# EAGLE design clock (EAGLE 6.4)
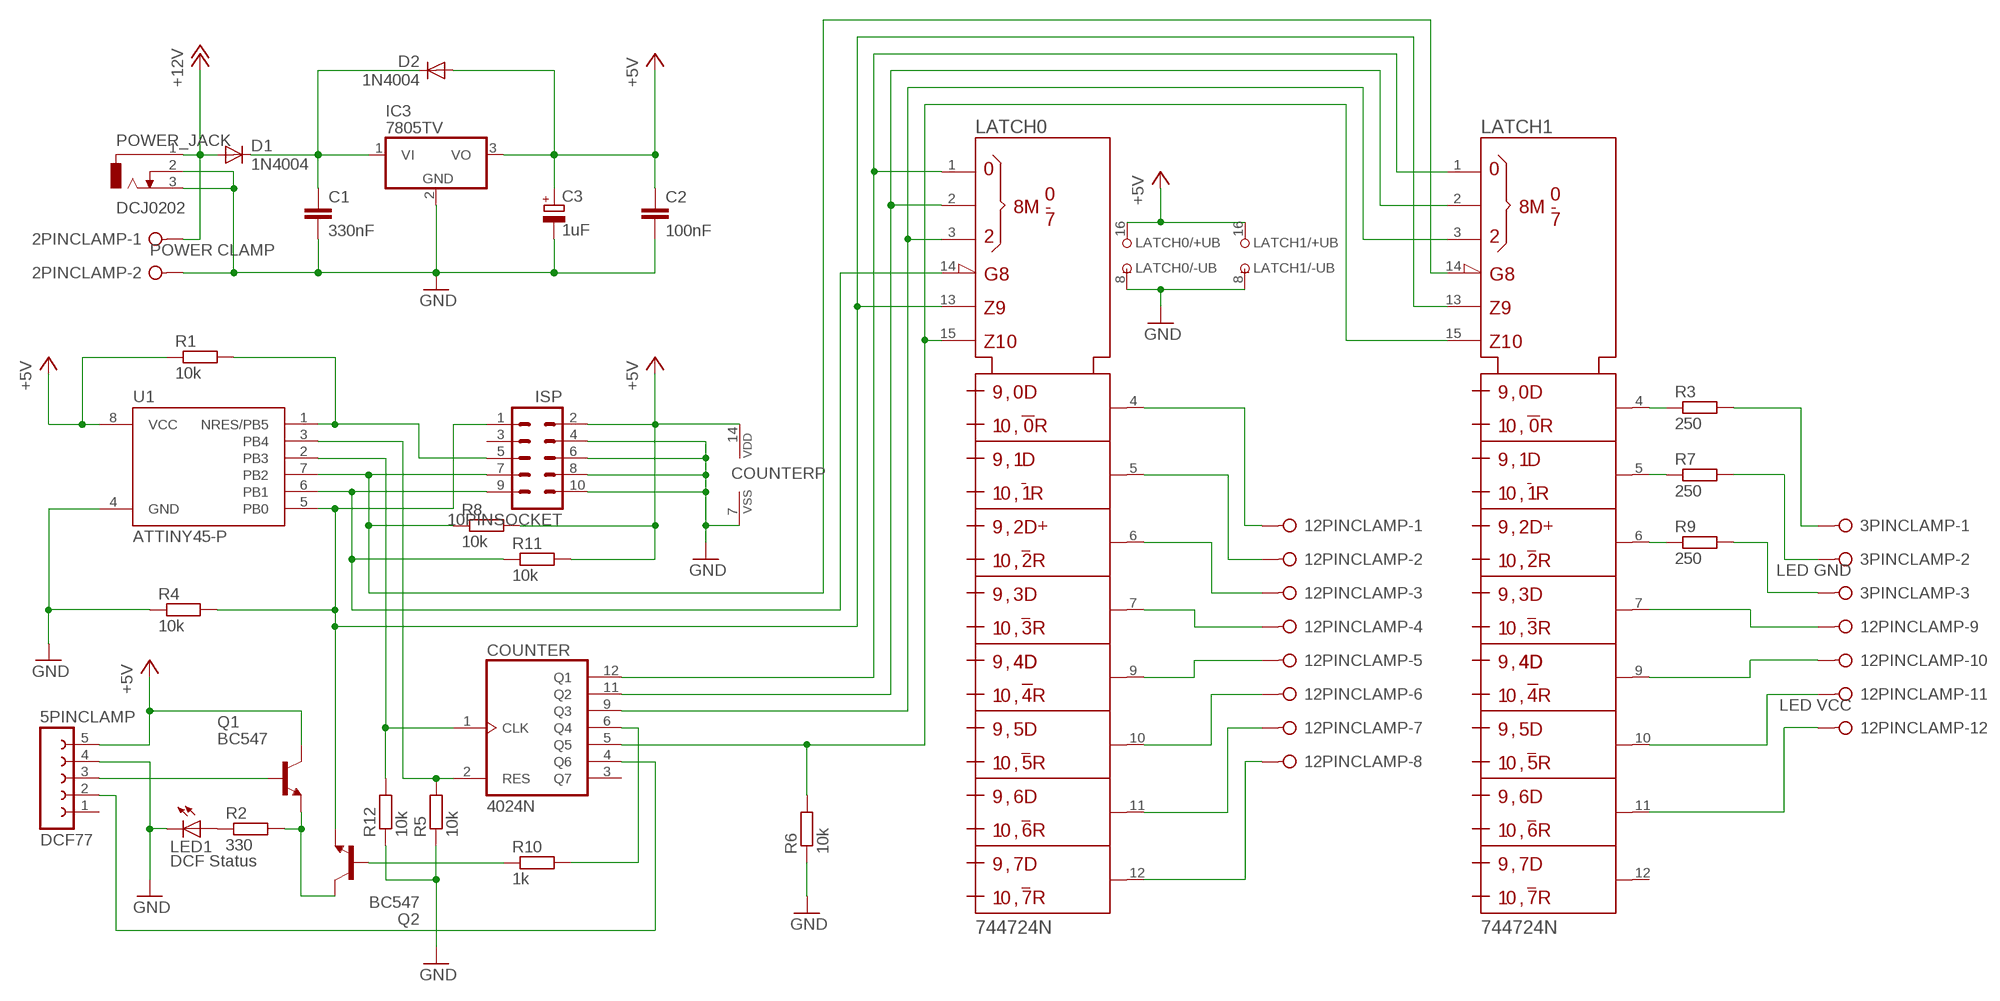
[diagram p0: schematic, sheet 1]

## Parts
2PINCLAMP  POWER CLAMP  W237-02P  [W237-132]
3PINCLAMP  LED GND  W237-3E  [W237-3E]
5PINCLAMP  DCF77  FE05-1  [FE05-1]
10PINSOCKET  ISP  ML10  [ML10]
12PINCLAMP  LED VCC  W237-12P  [W237-12P]
C1  330nF  C-EU050-025X075  [C050-025X075]
C2  100nF  C-EU050-025X075  [C050-025X075]
C3  1uF  CPOL-EUE2-4  [E2-4]
COUNTER  4024N  [DIL14]
D1  1N4004  [DO41-10]
D2  1N4004  [DO41-10]
IC3  7805TV  [TO220V]
LATCH0  744724N  [DIL16]
LATCH1  744724N  [DIL16]
LED1  DCF Status  LED5MM  [LED5MM]
POWER_JACK  DCJ0202  [DCJ0202]
Q1  BC547  [TO92]
Q2  BC547  [TO92]
R1  10k  R-EU_0204/5  [0204/5]
R2  330  R-EU_0204/5  [0204/5]
R3  250  R-EU_0204/5  [0204/5]
R4  10k  R-EU_0204/5  [0204/5]
R5  10k  R-EU_0204/5  [0204/5]
R6  10k  R-EU_0204/5  [0204/5]
R7  250  R-EU_0204/5  [0204/5]
R8  10k  R-EU_0204/5  [0204/5]
R9  250  R-EU_0204/5  [0204/5]
R10  1k  R-EU_0204/5  [0204/5]
R11  10k  R-EU_0204/5  [0204/5]
R12  10k  R-EU_0204/5  [0204/5]
U1  ATTINY45-P  [PDIP08_300MIL]

## Nets
+5V: 5PINCLAMP.5 10PINSOCKET.2 C2.1 C3.+ COUNTER.14(VDD) D2.A IC3.3(VO) LATCH0.16(+UB) LATCH1.16(+UB) Q1.3(C) R1.1 R8.2 R11.2 U1.8(VCC)
+12V: 2PINCLAMP.1 D1.A POWER_JACK.1
CLOCK: COUNTER.1(CLK) R12.2 U1.2(PB3)
DATA: 10PINSOCKET.1 LATCH0.13(D) LATCH1.13(D) Q2.1(E) R4.2 U1.5(PB0)
DCF_DATA: 5PINCLAMP.3 Q1.2(B)
DCF_PON: 5PINCLAMP.2 COUNTER.4(Q6)
GND: 2PINCLAMP.2 5PINCLAMP.4 10PINSOCKET.4 10PINSOCKET.6 10PINSOCKET.8 10PINSOCKET.10 C1.2 C2.2 C3.- COUNTER.7(VSS) IC3.2(GND) LATCH0.8(-UB) LATCH1.8(-UB) LED1.K(C) POWER_JACK.2 POWER_JACK.3 R4.1 R5.1 R6.1 R12.1 U1.4(GND)
LATCH0: 10PINSOCKET.7 LATCH1.14(!G) R8.1 U1.7(PB2)
LATCH1: 10PINSOCKET.9 LATCH0.14(!G) R11.1 U1.6(PB1)
N$1: 12PINCLAMP.1 LATCH0.4(Q0)
N$2: 12PINCLAMP.6 LATCH0.10(Q5)
N$3: 12PINCLAMP.2 LATCH0.5(Q1)
N$4: 12PINCLAMP.8 LATCH0.12(Q7)
N$5: 12PINCLAMP.7 LATCH0.11(Q6)
N$6: 12PINCLAMP.5 LATCH0.9(Q4)
N$7: 12PINCLAMP.4 LATCH0.7(Q3)
N$8: 12PINCLAMP.3 LATCH0.6(Q2)
N$9: 3PINCLAMP.2 R7.2
N$10: 3PINCLAMP.3 R9.2
N$11: 12PINCLAMP.9 LATCH1.7(Q3)
N$13: LATCH1.4(Q0) R3.1
N$14: 12PINCLAMP.11 LATCH1.10(Q5)
N$15: 12PINCLAMP.12 LATCH1.11(Q6)
N$16: LED1.A R2.1
N$17: C1.1 D1.C D2.C IC3.1(VI)
N$18: Q1.1(E) Q2.3(C) R2.2
N$19: LATCH1.6(Q2) R9.1
N$20: COUNTER.6(Q4) R10.2
N$21: LATCH1.5(Q1) R7.1
N$22: COUNTER.5(Q5) LATCH0.15(CLR) LATCH1.15(CLR) R6.2
N$23: 10PINSOCKET.5 R1.2 U1.1(NRES/PB5)
N$24: COUNTER.12(Q1) LATCH0.1(S0) LATCH1.1(S0)
N$25: Q2.2(B) R10.1
N$26: 3PINCLAMP.1 R3.2
N$27: COUNTER.9(Q3) LATCH0.3(S2) LATCH1.3(S2)
N$28: COUNTER.11(Q2) LATCH0.2(S1) LATCH1.2(S1)
N$30: 12PINCLAMP.10 LATCH1.9(Q4)
RESET: COUNTER.2(RES) R5.2 U1.3(PB4)
Unconnected: 5PINCLAMP.1 10PINSOCKET.3 COUNTER.3(Q7) LATCH1.12(Q7)

## Library data of the parts
2PINCLAMP = con-wago-508:W237-02P: WAGO SREW CLAMP; OC_FARNELL: unknown; OC_NEWARK: unknown
3PINCLAMP = con-wago-508:W237-3E: WAGO SREW CLAMP; OC_FARNELL: unknown; OC_NEWARK: unknown
5PINCLAMP = con-lsta:FE05-1: FEMALE HEADER; OC_FARNELL: unknown; OC_NEWARK: unknown
10PINSOCKET = con-harting-ml:ML10: HARTING; OC_FARNELL: unknown; OC_NEWARK: unknown
12PINCLAMP = con-wago-508:W237-12P: WAGO SREW CLAMP; OC_FARNELL: unknown; OC_NEWARK: unknown
C1 C2 = rcl:C-EU: CAPACITOR, European symbol
C3 = rcl:CPOL-EU: POLARIZED CAPACITOR, European symbol
COUNTER = 40xx:4024: 7-stage binary/ripple COUNTER
D1 D2 = diode:1N4004: DIODE general purpose rectifier, 1 A
IC3 = linear:78*: Positive VOLTAGE REGULATOR Source: http://cache.national.com/ds/LM/LM78L05.pdf http://www.fairchildsemi.com/ds/LM/LM7805.pdf
LATCH0 LATCH1 = 74ttl-din:74*4724: 8 Bit Addressable LATCH
LED1 = led:LED: LED OSRAM: - CHIPLED LG R971, LG N971, LY N971, LG Q971, LY Q971, LO R971, LY R971 LH N974, LH R974 LS Q976, LO Q976, LY Q976 LO Q996 - Hyper CHIPLED LW Q18S LB Q993, LB Q99A, LB R99A - SideLED LS A670, LO A670, LY A670, LG A670, LP A670 LB A673, LV A673, LT A673, LW A673 LH A674 LY A675 LS A676, LA A676, LO A676, LY A676, LW A676 LS A679, LY A679, LG A679 - Hyper Micro SIDELED® LS Y876, LA Y876, LO Y876, LY Y876 LT Y87S - SmartLED LW L88C, LW L88S LB L89C, LB L89S, LG L890 LS L89K, LO L89K, LY L89K LS L896, LA L896, LO L896, LY L896 - TOPLED LS T670, LO T670, LY T670, LG T670, LP T670 LSG T670, LSP T670, LSY T670, LOP T670, LYG T670 LG T671, LOG T671, LSG T671 LB T673, LV T673, LT T673, LW T673 LH T674 LS T676, LA T676, LO T676, LY T676, LB T676, LH T676, LSB T676, LW T676 LB T67C, LV T67C, LT T67C, LS T67K, LO T67K, LY T67K, LW E67C LS E67B, LA E67B, LO E67B, LY E67B, LB E67C, LV E67C, LT E67C LW T67C LS T679, LY T679, LG T679 LS T770, LO T770, LY T770, LG T770, LP T770 LB T773, LV T773, LT T773, LW T773 LH T774 LS E675, LA E675, LY E675, LS T675 LS T776, LA T776, LO T776, LY T776, LB T776 LHGB T686 LT T68C, LB T68C - Hyper Mini TOPLED® LB M676 - Mini TOPLED Santana® LG M470 LS M47K, LO M47K, LY M47K Source: http://www.osram.convergy.de LUXEON: - LUMILED® LXK2-PW12-R00, LXK2-PW12-S00, LXK2-PW14-U00, LXK2-PW14-V00 LXK2-PM12-R00, LXK2-PM12-S00, LXK2-PM14-U00 LXK2-PE12-Q00, LXK2-PE12-R00, LXK2-PE12-S00, LXK2-PE14-T00, LXK2-PE14-U00 LXK2-PB12-K00, LXK2-PB12-L00, LXK2-PB12-M00, LXK2-PB14-N00, LXK2-PB14-P00, LXK2-PB14-Q00 LXK2-PR12-L00, LXK2-PR12-M00, LXK2-PR14-Q00, LXK2-PR14-R00 LXK2-PD12-Q00, LXK2-PD12-R00, LXK2-PD12-S00 LXK2-PH12-R00, LXK2-PH12-S00 LXK2-PL12-P00, LXK2-PL12-Q00, LXK2-PL12-R00 Source: www.luxeon.com KINGBRIGHT: KA-3528ASYC Source: www.kingbright.com
POWER_JACK = con-jack:DCJ0202: DC POWER JACK Source: DCJ0202.pdf; OC_FARNELL: unknown; OC_NEWARK: unknown
Q1 Q2 = transistor-npn:BC547*: NPN Transistor
R1-R12 = resistor:R-EU_: RESISTOR, European symbol
U1 = _hhn_attiny25_45_85:ATTINY45*: ATMEL ATtiny 45 Packages: P = PDIP 08 30mil S = SOIC 08 EIAJ 208mil X = TSSOP 08 4.4mm Technologies Note: for complete ordering code (temp. range, finish, tape&reel etc.) see www.atmel.com • Supply Voltage: V = (1.8…5.5)V | [blank] = (2.7…5.5)V • Speed: 10 = 10 MHz | 20 = 20 MHz Author: Dipl.-Ing. FH Rainer Bayer HHN Hochschule Heilbronn (Heilbronn University), rainer.bayer@hs-heilbronn.de Ingenieurbüro ing-rb, mail@ing-rb.de

## Board
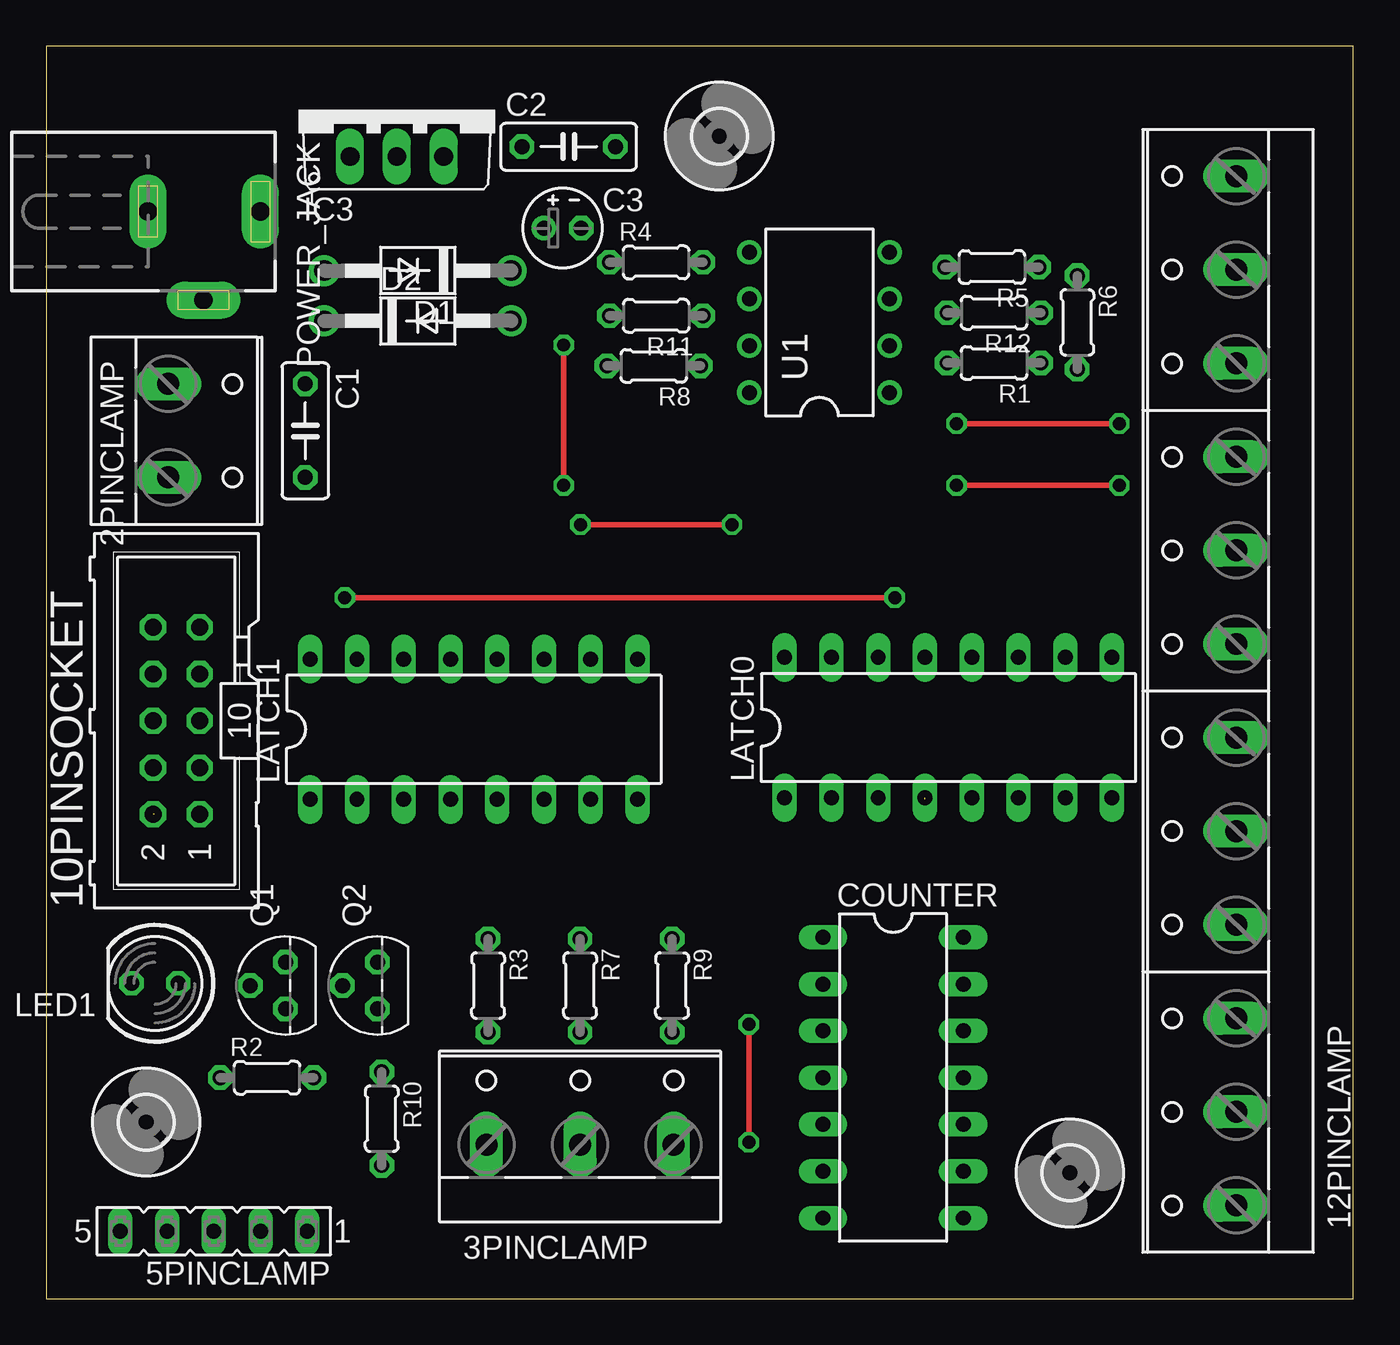
[diagram p1: board, top side]
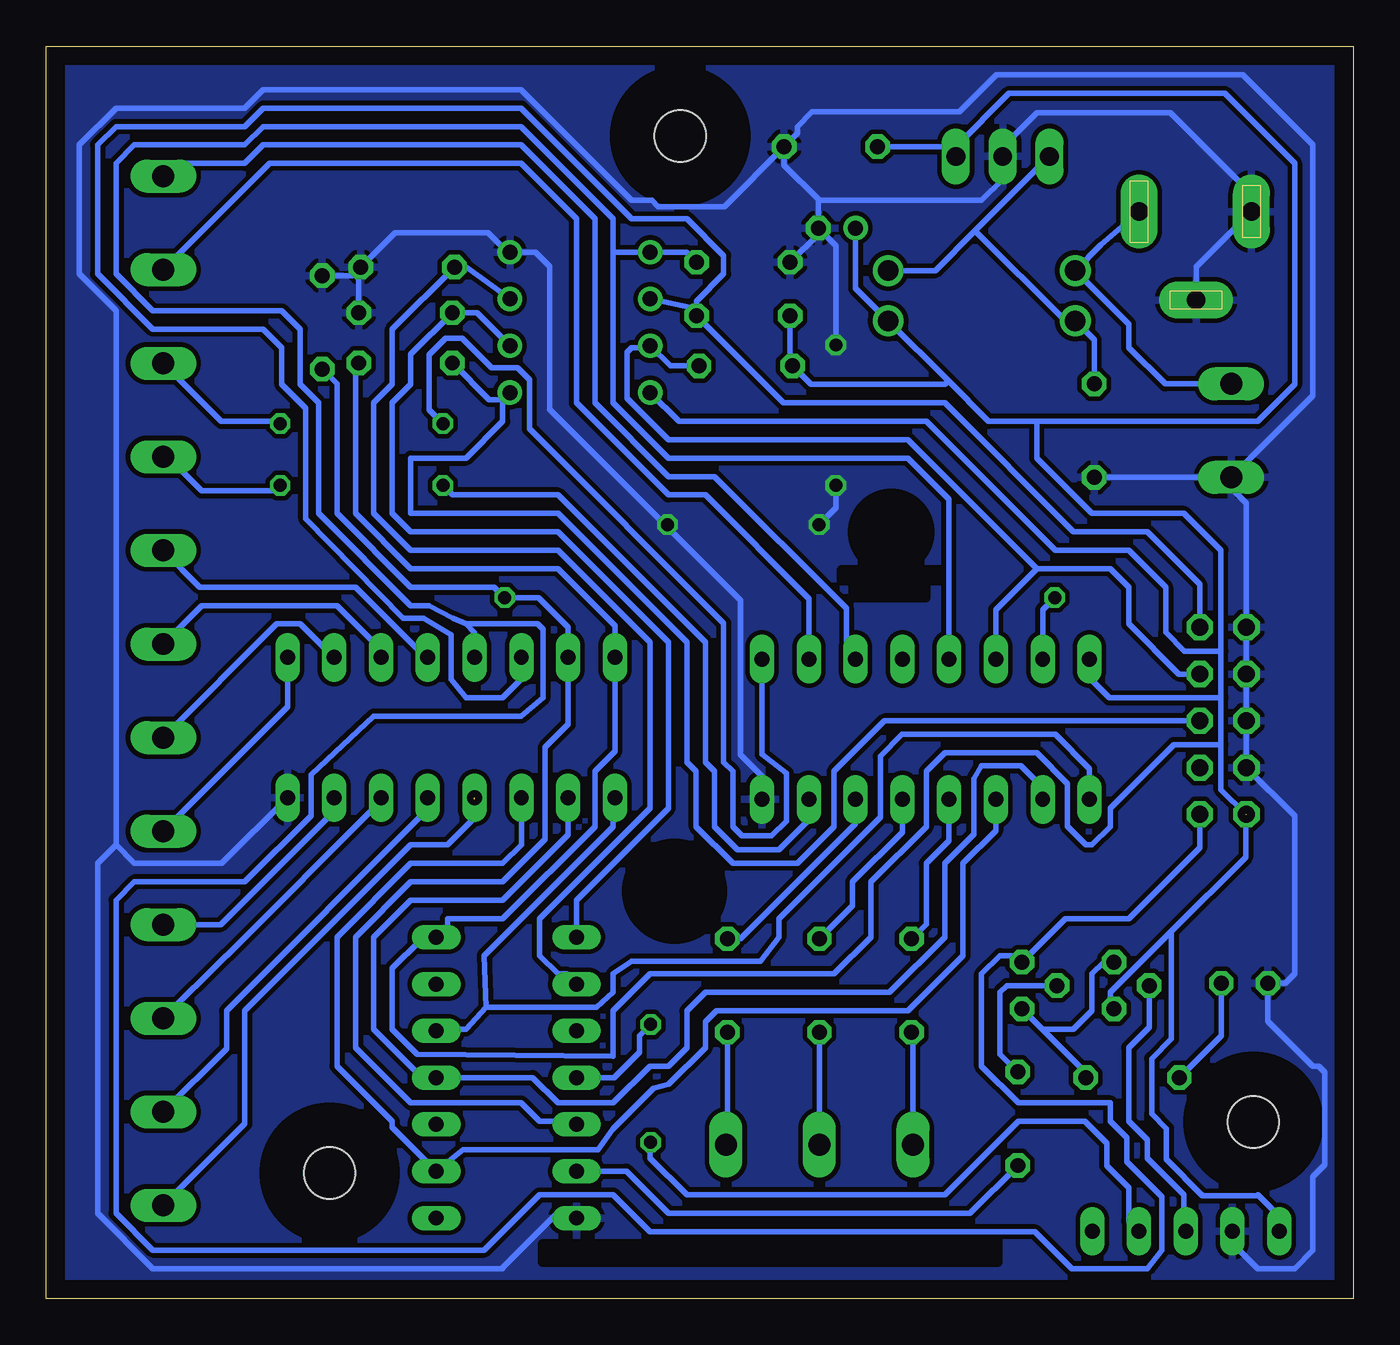
[diagram p2: board, bottom side, seen from below]

Size 71 x 68 mm. Coordinates in mm from the lower left corner, seen from the top.
Outline: 0,0 71,0 71,68 0,68 0,0
Copper layers (1*16): Top 0.035mm / dielectric 1.5mm / Bottom 0.035mm
Design rules "default *": minimum track width 12mil, minimum drill 27mil, track to track 8mil, track to pad 8mil, pad to pad 8mil, via to via 8mil, smd to smd 8mil, copper to edge 40mil, drill to drill 8mil, minimum pad ring 10mil, minimum via ring 8mil, stop-mask expansion 4mil, vias tented up to drill 0mil, thermal gap 10mil
bRestrict: area 24.1,40.6 to 26.1,42.6; area 35.9,21.1 to 37.9,23.1; area 19.3,2 to 44,3; area 23.2,38.1 to 27.2,38.7; area 22.6,39 to 27.8,39.6

### Footprints (pad centres in the part's own frame; a part is rotated, then mirrored left to right if it is on the bottom)
W237-132 = drill 1.194 long: 1 -2.54,-0.635; 2 2.54,-0.635
W237-3E = drill 1.194 long: 1 -5.08,-0.635; 2 0,-0.635; 3 5.08,-0.635
FE05-1 = drill 0.813 long: 1 -5.08,0; 2 -2.54,0; 3 0,0; 4 2.54,0; 5 5.08,0
ML10 = drill 0.914 octagon: 1 -5.08,-1.27; 2 -5.08,1.27; 3 -2.54,-1.27; 4 -2.54,1.27; 5 0,-1.27; 6 0,1.27; 7 2.54,-1.27; 8 2.54,1.27; 9 5.08,-1.27; 10 5.08,1.27
W237-12P = drill 1.194 long: 1 -27.94,-0.635; 2 -22.86,-0.635; 3 -17.78,-0.635; 4 -12.7,-0.635; 5 -7.62,-0.635; 6 -2.54,-0.635; 7 2.54,-0.635; 8 7.62,-0.635; 9 12.7,-0.635; 10 17.78,-0.635; 11 22.86,-0.635; 12 27.94,-0.635
C050-025X075 = drill 0.813 octagon: 1 -2.54,0; 2 2.54,0
E2-4 = drill 0.813 pad 1.27: + -1.016,0 | drill 0.813 pad 1.27 octagon: - 1.016,0
DIL14 = drill 0.813 long: 1 -7.62,-3.81; 2 -5.08,-3.81; 3 -2.54,-3.81; 4 0,-3.81; 5 2.54,-3.81; 6 5.08,-3.81; 7 7.62,-3.81; 8 7.62,3.81; 9 5.08,3.81; 10 2.54,3.81; 11 0,3.81; 12 -2.54,3.81; 13 -5.08,3.81; 14 -7.62,3.81
DO41-10 = drill 1.118: A 5.08,0; C -5.08,0
TO220V = drill 1.016 long: 1 -2.54,-2.54; 2 0,-2.54; 3 2.54,-2.54
DIL16 = drill 0.813 long: 1 -8.89,-3.81; 2 -6.35,-3.81; 3 -3.81,-3.81; 4 -1.27,-3.81; 5 1.27,-3.81; 6 3.81,-3.81; 7 6.35,-3.81; 8 8.89,-3.81; 9 8.89,3.81; 10 6.35,3.81; 11 3.81,3.81; 12 1.27,3.81; 13 -1.27,3.81; 14 -3.81,3.81; 15 -6.35,3.81; 16 -8.89,3.81
LED5MM = drill 0.813 octagon: A -1.27,0; K 1.27,0
DCJ0202 = drill 1 pad 2 long: 1 0,3.1; 2 4.8,0; 3 0,-3
TO92 = drill 0.813 octagon: 1 1.27,0; 2 0,1.905; 3 -1.27,0
0204/5 = drill 0.813 octagon: 1 -2.54,0; 2 2.54,0
PDIP08_300MIL = drill 0.813: 1 -3.81,-3.81; 2 -1.27,-3.81; 3 1.27,-3.81; 4 3.81,-3.81; 5 3.81,3.81; 6 1.27,3.81; 7 -1.27,3.81; 8 -3.81,3.81
2,8 = hole 2.8: 0,0

### Placement (x,y rotation side)
2PINCLAMP  7.27,47.12 270 top
3PINCLAMP  29,9 0 top
5PINCLAMP  9.11,3.66 180 top
10PINSOCKET  7.08,31.37 90 top
12PINCLAMP  64,33 90 top
C1  14.08,47.12 270 top
C2  28.38,62.54 0 top
C3  28.05,58.12 0 top
COUNTER  46,12 270 top
D1  20.19,55.81 180 top
D2  20.19,53.08 0 top
IC3  19.05,64.55 0 top
LATCH0  49,31 0 top
LATCH1  23.23,30.91 0 top
LED1  5.91,17.12 180 top
POWER_JACK  8.54,59.01 270 top
Q1  13,17 90 top
Q2  18,17 90 top
R1  51.48,50.8 180 top
R2  12,12 0 top
R3  24,17 270 top
R4  33.13,56.26 0 top
R5  51.37,56 180 top
R6  56,53 270 top
R7  29,17 270 top
R8  33,50.63 180 top
R9  34,17 270 top
R10  18.23,9.77 270 top
R11  33.13,53.35 180 top
R12  51.48,53.52 180 top
U1  42,53 90 top
U$1  [2,8]  36.56,63.11 0 top
U$2  [2,8]  5.44,9.59 0 top
U$3  [2,8]  55.6,6.83 0 top

### Tracks (layer width: path | path; a pad name or v marks a point on that pad's centre or on a via)
+5V  (1 unrouted)
  Bottom 0.305: 17.2,47.63 5.2,47.63 3.2,49.63 3.2,61.63 7,65.43 18.7,65.43 21.59,62.54 IC3.3 22.12,62.54 C2.1 | 17.2,47.63 19.82,47.63 22.01,49.82 | 22.01,49.82 D2.A 27.03,54.84 C3.+ | 7.2,30.07 7.2,27.63 5.86,26.29 5.86,23.97 9.88,19.95 | 7.2,30.07 7.2,32.63 | 7.2,32.63 7.2,35.16 | 7.2,35.16 7.2,40.63 9.2,42.63 14.2,42.63 17.2,45.63 17.2,47.63 | 9.88,19.95 13.2,16.63 13.2,15.93 Q1.3 | 7.2,32.63 7.21,32.62 13.27,32.62 14.34,33.7 LATCH1.16 | 7.2,35.16 9.19,35.16 10.2,36.18 10.2,38.63 12.2,40.63 16.2,40.63 23.2,47.63 36.63,47.63 U1.8 | R1.1 54.2,50.61 54.2,42.63 51.2,39.63 43.2,39.63 40.11,36.54 LATCH0.16 40.11,29.72 41.2,28.63 41.2,25.63 46.2,20.63 49.2,20.63 49.2,20.23 COUNTER.14 49.97,19.46 50.66,19.46 52.2,17.93 52.2,14.63 50.84,13.27 40.2,13.17 40.2,15.63 38.2,17.63 28.2,17.63 26.2,19.63 26.2,22.63 23.2,25.63 23.2,28.63 22.2,29.63 17.2,29.63 15.54,27.97 15.54,25.64 14.53,24.63 14.2,24.63 13.2,25.63 13.2,26.63 9.76,30.07 7.2,30.07 | R11.2 30.59,50.77 R8.2 29.45,49.63 22.2,49.63 22.01,49.82 | 9.88,19.95 9.88,14.11 10.96,13.03 10.96,10.03 10.16,9.23 10.16,7.56 8.2,5.6 | 8.2,5.63 8.2,5.6 | 8.2,5.6 5.23,5.6 5.2,5.63 4.2,4.63 4.2,3.83 5PINCLAMP.5
+12V
  Bottom 0.305: POWER_JACK.1 13.71,57.21 D1.A 12.2,52.9 12.2,51.63 10.23,49.66 2PINCLAMP.1
CLOCK
  Bottom 0.305: COUNTER.1 42.19,21.64 37.2,26.63 37.2,35.63 43.2,41.63 51.2,41.63 52.2,42.63 52.2,48.63 51.2,49.63 51.2,51.26 R12.2 47.61,53.52 U1.2
DATA
  Bottom 0.305: LATCH0.13 47.73,36.16 48.2,36.63 | 48.2,36.63 48.9,36.93 50.2,37.63 51.2,37.63 56.2,42.63 56.2,48.63 57.2,49.63 57.2,52.63 58.2,53.63 65.2,53.63 67.2,55.63 67.2,61.63 66.2,62.63 60.2,62.63 59.2,63.63 45.2,63.63 40.2,58.63 40.2,56.8 | 48.2,36.63 44.31,36.63 44.01,36.33 44.01,32.62 45.2,31.63 53.2,31.63 56.6,28.43 56.6,26.23 60.2,22.63 66.2,22.63 67.2,21.63 67.2,4.63 65.2,2.63 47.2,2.63 44.2,5.63 40.2,5.63 38.2,3.63 17.3,3.63 15.3,1.63 11.2,1.63 10.4,2.63 10.4,5.53 12.3,7.43 12.3,8.73 13.2,9.63 13.2,10.63 18.2,10.63 20.2,12.63 20.2,17.63 19.2,18.63 18.36,18.63 Q2.1 15.64,20.63 12.2,20.63 8.35,24.48 10PINSOCKET.1 | 40.2,56.8 40.2,48.63 37.2,45.63 24.2,45.63 21.96,43.39 LATCH1.13 | 40.2,56.8 U1.5 36.22,56.81 R4.2
DCF_DATA
  Bottom 0.305: Q1.2 11.09,14.74 12.2,13.63 12.2,9.63 11.2,8.63 11.2,7.63 9.2,5.63 9.2,3.75 5PINCLAMP.3
DCF_PON  (via drill 0.7)
  Top 0.305: v38.17,8.49 v38.17,14.89
  Bottom 0.305: COUNTER.4 40.14,12 38.78,13.37 38.78,14.28 v38.17,14.89 | 5PINCLAMP.2 12.2,4.21 12.2,6.03 13.4,7.23 13.4,8.43 14.6,9.63 18.2,9.63 22.2,5.63 36.2,5.63 38.2,7.63 38.2,8.46 v38.17,8.49
GND  (via drill 0.7)
  Top 0.305: v28.11,51.77 v28.11,44.15 | v29.02,42.02 v37.25,42.02
  Bottom 0.305: 7.2,44.58 2PINCLAMP.2 2.2,49.02 2.2,62.63 6,66.43 19.4,66.43 21.4,64.43 29.4,64.43 30.2,63.63 30.2,63.26 C2.2 | 7.2,44.58 C1.2 | 7.2,44.58 5.81,43.19 10PINSOCKET.10 10PINSOCKET.8 10PINSOCKET.6 10PINSOCKET.4 3.2,26.22 3.2,17.63 3.71,17.12 LED1.K 4.64,15.07 2.2,12.63 1.9,12.63 1.57,12.3 1.57,7.27 2.2,6.63 2.2,2.63 3.2,1.63 5.2,1.63 6.2,2.63 6.2,3.29 5PINCLAMP.4 | 67.2,24.63 67.2,53.63 69.2,55.63 69.2,62.63 67.2,64.63 60.2,64.63 59.2,65.63 45.2,65.63 39.2,59.63 38.1,59.63 37.76,59.29 34.17,59.29 C2.2 | 67.2,24.63 66.2,23.63 61.45,23.63 LATCH0.8 | 67.2,24.63 68.2,23.63 68.2,4.63 65.2,1.63 46.2,1.63 46.2,1.68 43.35,4.53 42.34,4.53 COUNTER.7 | C3.- 28.11,57.16 v28.11,51.77 | C3.- 29.07,59.69 | 29.07,59.69 29.01,59.63 20.2,59.63 19.05,60.78 IC3.2 19.2,62.16 19.2,62.38 17.2,64.38 9.95,64.38 5.2,59.63 5.2,59.35 POWER_JACK.3 | C3.- 29.07,57.78 R4.1 | C2.2 30.92,61.54 29.07,59.69 | POWER_JACK.2 8.54,56.01 POWER_JACK.3 | POWER_JACK.3 5.58,59.01 | R12.1 54.02,55.89 R5.1 | R6.1 54.37,55.54 R5.1 | R5.1 52.04,57.87 47.01,57.87 45.95,56.81 U1.4 44.42,56.81 43.65,56.04 43.65,48.27 37.4,42.02 v37.25,42.02 37.25,41.87 33.29,37.91 33.29,29.52 32.12,28.35 LATCH1.8 | v28.11,44.15 28.11,42.93 v29.02,42.02
  pour Bottom (isolate 0.254): 0.07,67.62 70.78,67.62 70.78,0.26 0.07,0.26
LATCH0
  Bottom 0.305: 17.2,39.63 13.2,39.63 12.2,38.63 12.2,36.63 9.48,33.91 10PINSOCKET.7 | 17.2,39.63 24.2,46.63 37.2,46.63 39.45,48.88 39.45,51.38 39.2,51.63 38.29,51.63 U1.7 37.1,50.63 R8.1 | LATCH1.14 19.42,37.41 17.2,39.63
LATCH1
  Bottom 0.305: LATCH0.14 45.2,33.63 46.2,32.63 48.2,32.63 49,33.63 49,36.03 50.5,36.93 51.6,36.93 56.9,42.33 56.9,48.33 58.2,49.63 58.2,51.63 59.2,52.63 65.2,52.63 68.2,55.63 68.2,62.63 67.2,63.63 60.2,63.63 59.2,64.63 45.2,64.63 39.2,58.63 36.2,58.63 34.2,56.63 34.2,55.63 35.67,54.16 R11.1 | R11.1 35.67,53.75 U1.6 | R11.1 30.95,48.63 22.2,48.63 15.2,41.63 11.2,41.63 8.35,38.78 10PINSOCKET.9
N$1  (1 unrouted)
  Bottom 0.305: 12PINCLAMP.1 60.2,9.49 60.2,15.63 51.2,24.63 49.2,24.63 47.73,26.1 47.73,27.1
N$2
  Bottom 0.305: LATCH0.10 55.38,34.81 57.2,36.63 58.47,36.63 12PINCLAMP.6
N$3
  Bottom 0.305: 12PINCLAMP.2 61.2,13.58 61.2,15.63 50.27,26.56 LATCH0.5
N$4
  Bottom 0.305: LATCH0.12 50.38,34.81 54.2,38.63 62.65,38.63 12PINCLAMP.8
N$5
  Bottom 0.305: 12PINCLAMP.7 62.55,37.63 55.2,37.63 52.81,35.24 LATCH0.11
N$6
  Bottom 0.305: LATCH0.9 57.89,32.12 12PINCLAMP.5
N$7
  Bottom 0.305: 12PINCLAMP.4 61.53,20.3 55.2,26.63 55.2,27.04 LATCH0.7
N$8
  Bottom 0.305: LATCH0.6 52.81,27.02 61.2,18.63 61.23,18.63 12PINCLAMP.3
N$9
  Bottom 0.305: R7.2 3PINCLAMP.2
N$10
  Bottom 0.305: R9.2 34,8.45 3PINCLAMP.3
N$11  (via drill 0.7)
  Top 0.305: v49.44,44.15 v58.28,44.15
  Bottom 0.305: LATCH1.7 29.58,26 31.2,24.38 33.45,24.38 34.7,25.63 34.7,28.63 35.2,29.13 35.2,35.63 43.2,43.63 48.92,43.63 v49.44,44.15 | 12PINCLAMP.9 64.4,45.7 62.55,43.85 58.59,43.85 v58.28,44.15
N$13
  Bottom 0.305: LATCH1.4 21.96,24.87 23.2,23.63 23.2,20.34 R3.1
N$14
  Bottom 0.305: LATCH1.10 29.58,38.01 35.2,43.63 37.2,43.63 42.2,48.63 42.2,58.63 45.2,61.63 58.87,61.63 12PINCLAMP.11 64.41,55.63
N$15
  Bottom 0.305: 12PINCLAMP.12 63.95,61.63 60.2,61.63 59.2,62.63 45.2,62.63 41.2,58.63 41.2,48.63 37.2,44.63 34.7,44.63 27.54,37.47 27.54,35.22 LATCH1.11
N$16
  Bottom 0.305: LED1.A 7.18,14.28 R2.1
N$17
  Bottom 0.305: C1.1 14.08,52.05 D2.C 15.65,53.08 20.54,57.98 | D1.C 22.71,55.81 20.54,57.98 | 20.54,57.98 IC3.1
N$18
  Bottom 0.305: Q1.1 13.56,18.27 14.2,17.63 14.2,15.63 15.2,14.63 16.9,14.63 | 16.9,14.63 17.05,14.78 Q2.3 | R2.2 14.54,12.27 16.9,14.63
N$19
  Bottom 0.305: LATCH1.6 27.04,25.79 33.29,19.54 R9.1
N$20
  Bottom 0.305: COUNTER.6 39.49,6.92 37.2,4.63 20.83,4.63 R10.2
N$21
  Bottom 0.305: LATCH1.5 24.5,25.33 27.2,22.63 27.2,21.34 R7.1
N$22  (via drill 0.7)
  Top 0.305: v16.22,38.06 v46.09,38.06
  Bottom 0.305: COUNTER.5 42.36,9.63 44.2,9.63 45.2,10.63 51.2,10.63 54.2,13.63 54.2,19.63 51.2,22.63 46.2,22.63 43.9,24.94 43.9,29.94 42.65,31.18 LATCH0.15 42.65,36.44 44.26,38.06 v46.09,38.06 46.67,38.63 51.2,38.63 55.2,42.63 55.2,49.66 R6.2 | LATCH1.15 16.88,37.4 v16.22,38.06
N$23
  Bottom 0.305: 46.2,48.8 46.2,47.63 48.2,45.63 51.2,45.63 51.2,42.63 43.2,42.63 36.2,35.63 36.2,29.13 35.7,28.63 35.7,25.63 33.7,23.63 30.2,23.63 28.2,25.63 28.2,28.63 25.46,31.37 10PINSOCKET.5 | 46.2,48.8 U1.1 | 46.2,48.8 46.94,48.8 R1.2
N$24
  Bottom 0.305: 47.1,15.83 47.2,18.63 40.2,25.63 40.2,27.1 LATCH0.1 | 47.1,15.83 48.2,14.63 49.72,14.63 COUNTER.12 | 47.1,15.83 41.1,15.83 40.2,16.63 40.2,17.63 39.2,18.33 32.2,18.33 31.2,19.63 31.2,20.63 25.7,26.14 25.7,29.45 24.51,30.63 16.2,30.63 14.34,28.77 LATCH1.1
N$25
  Bottom 0.305: Q2.2 18.83,17 19.2,16.63 19.2,13.28 R10.1
N$26
  Bottom 0.305: 3PINCLAMP.1 23.92,14.38 R3.2
N$27
  Bottom 0.305: 19.42,26.41 LATCH1.3 19.42,25.41 21.2,23.63 21.2,18.63 24.2,15.63 34.6,15.63 35.2,15.03 35.2,13.63 37.2,11.63 38,11.43 40,9.43 40.2,9.22 41.04,8.09 48.34,8.09 COUNTER.9 52.2,9.31 52.2,9.63 55.2,12.63 55.2,19.63 51.2,23.63 46.2,23.63 45.19,24.64 LATCH0.3
N$28
  Bottom 0.305: LATCH0.2 42.65,25.18 46.2,21.63 51.2,21.63 53.2,19.63 53.2,14.63 50.57,12 COUNTER.11 44.57,12 43.2,10.63 40.2,10.63 38.2,12.63 37.2,12.63 36.2,13.63 36.2,15.63 35.2,16.63 25.2,16.63 22.2,19.63 22.2,23.63 20.61,25.22 20.61,28.22 20.2,28.93 18.07,28.93 17.14,28 17.14,27.36 LATCH1.2
N$30  (via drill 0.7)
  Top 0.305: v49.44,47.5 v58.28,47.5
  Bottom 0.305: LATCH1.9 32.12,29.55 30.8,28.53 30.8,25.93 31.6,25.13 33.2,25.13 33.7,25.63 33.7,28.63 34.2,29.13 34.2,36.68 44.75,47.23 44.75,49.88 45.4,50.53 46.8,50.53 48.4,52.13 49.3,52.13 50.2,51.23 50.2,48.26 v49.44,47.5 | 12PINCLAMP.10 61.48,47.63 58.41,47.63 v58.28,47.5
RESET
  Bottom 0.305: COUNTER.2 42.74,17.63 43.2,17.63 44.2,18.63 44.2,20.63 38.2,26.63 38.2,35.63 43.2,40.63 51.2,40.63 53.2,42.63 53.2,48.63 52.2,49.63 52.2,52.63 R5.2 48.55,56.27 U1.3

### Text on the board
Document: BulbdialClock v1 Yomin@Netz39